# EAGLE schematic Player (EAGLE 7.5.0)

## Sheet 1 of 2
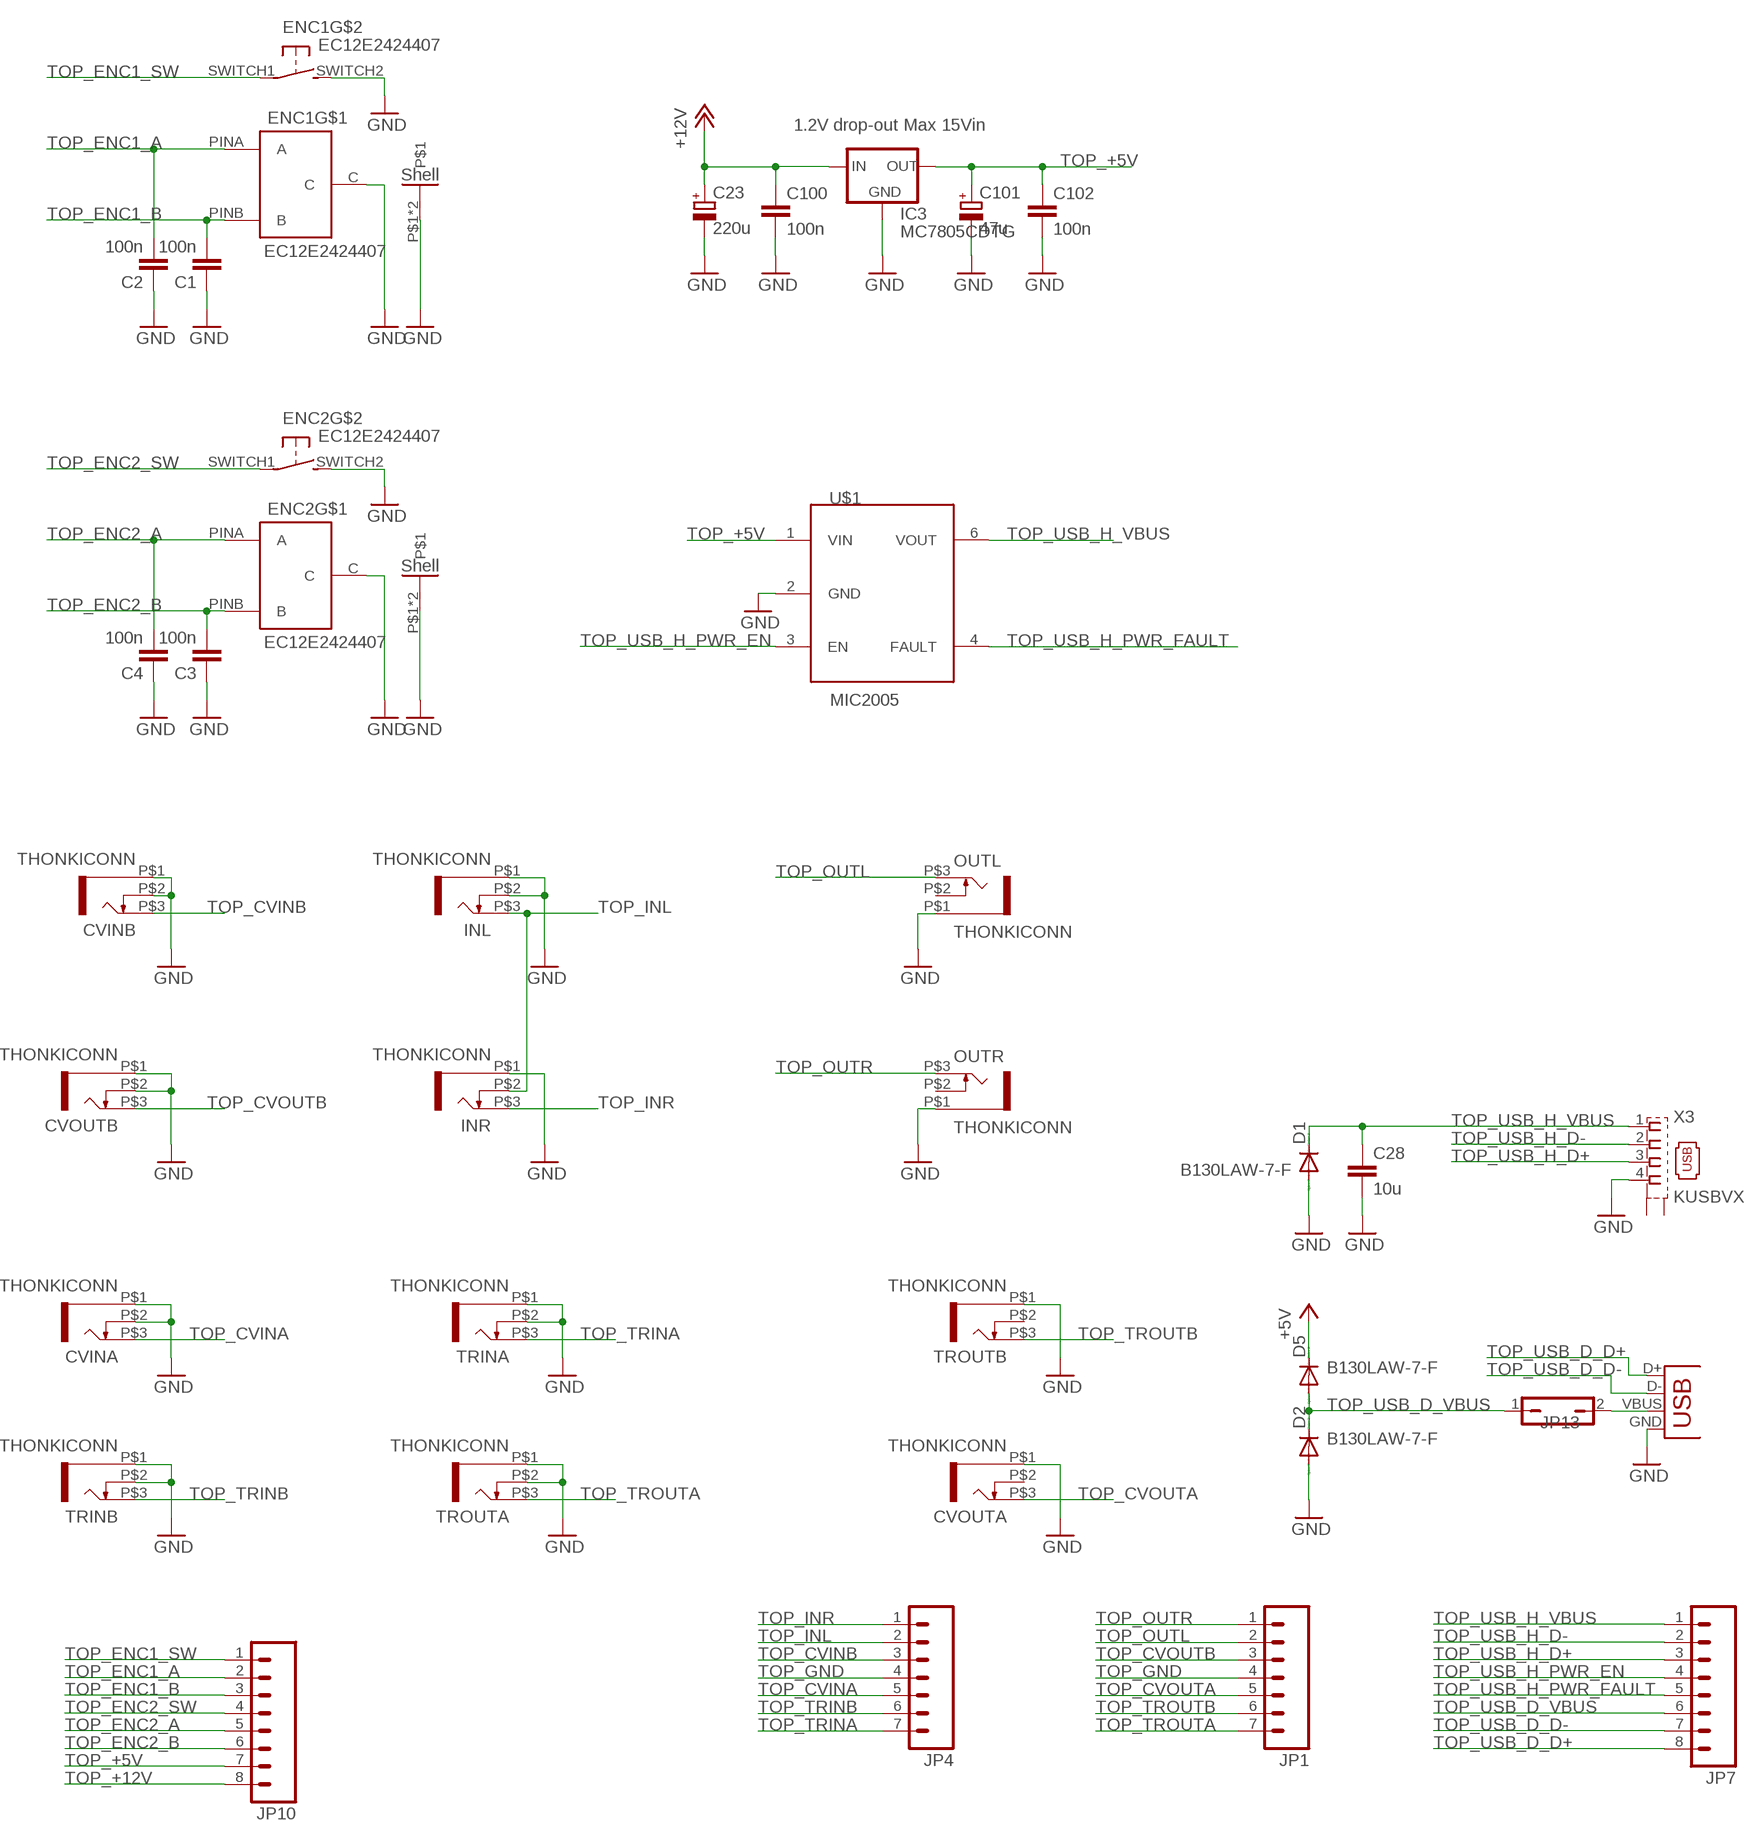
[diagram p0: schematic, sheet 1]

### Parts
C1  100n  C-EUC0603  [C0603]
C2  100n  C-EUC0603  [C0603]
C3  100n  C-EUC0603  [C0603]
C4  100n  C-EUC0603  [C0603]
C23  220u  CPOL-EUD  [PANASONIC_D]
C28  10u  C-EUC1206  [C1206]
C100  100n  C-EUC0603  [C0603]
C101  47u  CPOL-EU153CLV-0505  [CPOL-5]
C102  100n  C-EUC0603  [C0603]
CVINA  THONKICONN  [THONKICONN]
CVINB  THONKICONN  [THONKICONN]
CVOUTA  THONKICONN  [THONKICONN]
CVOUTB  THONKICONN  [THONKICONN]
D1  B130LAW-7-F  DIODE-SOD123  [SOD123]
D2  B130LAW-7-F  DIODE-SOD123  [SOD123]
D5  B130LAW-7-F  DIODE-SOD123  [SOD123]
ENC1  EC12E2424407  [EC12E2424407]
ENC2  EC12E2424407  [EC12E2424407]
IC3  MC7805CDTG  MC78XX  [DPACK]
INL  THONKICONN  [THONKICONN]
INR  THONKICONN  [THONKICONN]
JP1  M07  [1X07]
JP4  M07  [1X07]
JP7  M081X08  [1X08]
JP10  M081X08  [1X08]
JP13  JP1Q  [JP1]
OUTL  THONKICONN  [THONKICONN]
OUTR  THONKICONN  [THONKICONN]
TRINA  THONKICONN  [THONKICONN]
TRINB  THONKICONN  [THONKICONN]
TROUTA  THONKICONN  [THONKICONN]
TROUTB  THONKICONN  [THONKICONN]
U$1  MIC2005  [SOT23-6]
X3  KUSBVX  [KUSBVX]
X5  USBPTH-VERTICAL  [USB-B-PTH-VERTICAL]

### Nets
N$19: JP13.2 X5.VBUS
TOP_+5V: C101.+ C102.1 D5.C IC3.3(OUT) JP10.7 U$1.1(VIN) ; supply symbol labelled +5V
TOP_+12V: C23.+ C100.1 IC3.1(IN) JP10.8 ; supply symbol labelled +12V
TOP_CVINA: CVINA.P$3 JP4.5
TOP_CVINB: CVINB.P$3 JP4.3
TOP_CVOUTA: CVOUTA.P$3 JP1.5
TOP_CVOUTB: CVOUTB.P$3 JP1.3
TOP_ENC1_A: C2.2 ENC1.PINA(A) JP10.2
TOP_ENC1_B: C1.2 ENC1.PINB(B) JP10.3
TOP_ENC1_SW: ENC1.SWITCH1(P) JP10.1
TOP_ENC2_A: C4.2 ENC2.PINA(A) JP10.5
TOP_ENC2_B: C3.2 ENC2.PINB(B) JP10.6
TOP_ENC2_SW: ENC2.SWITCH1(P) JP10.4
TOP_GND: C1.1 C2.1 C3.1 C4.1 C23.- C28.2 C100.2 C101.- C102.2 CVINA.P$1 CVINA.P$2 CVINB.P$1 CVINB.P$2 CVOUTA.P$1 CVOUTB.P$1 CVOUTB.P$2 D1.A D2.A ENC1.C ENC1.P$1 ENC1.P$2 ENC1.SWITCH2(S) ENC2.C ENC2.P$1 ENC2.P$2 ENC2.SWITCH2(S) IC3.4(GND) INL.P$1 INL.P$2 INR.P$1 JP1.4 JP4.4 OUTL.P$1 OUTR.P$1 TRINA.P$1 TRINA.P$2 TRINB.P$1 TRINB.P$2 TROUTA.P$1 TROUTA.P$2 TROUTB.P$1 U$1.2(GND) X3.4 X5.GND ; supply symbol labelled GND
TOP_INL: INL.P$3 INR.P$2 JP4.2
TOP_INR: INR.P$3 JP4.1
TOP_OUTL: JP1.2 OUTL.P$3
TOP_OUTR: JP1.1 OUTR.P$3
TOP_TRINA: JP4.7 TRINA.P$3
TOP_TRINB: JP4.6 TRINB.P$3
TOP_TROUTA: JP1.7 TROUTA.P$3
TOP_TROUTB: JP1.6 TROUTB.P$3
TOP_USB_D_D+: JP7.8 X5.D+
TOP_USB_D_D-: JP7.7 X5.D-
TOP_USB_D_VBUS: D2.C D5.A JP7.6 JP13.1
TOP_USB_H_D+: JP7.3 X3.3
TOP_USB_H_D-: JP7.2 X3.2
TOP_USB_H_PWR_EN: JP7.4 U$1.3(EN)
TOP_USB_H_PWR_FAULT: JP7.5 U$1.4(FAULT)
TOP_USB_H_VBUS: C28.1 D1.C JP7.1 U$1.6(VOUT) X3.1
Unconnected: CVOUTA.P$2 OUTL.P$2 OUTR.P$2 TROUTB.P$2 X3.M1(S1) X3.M2(S2)

### Notes on the sheet
- 1.2V drop-out Max 15Vin

## Sheet 2 of 2
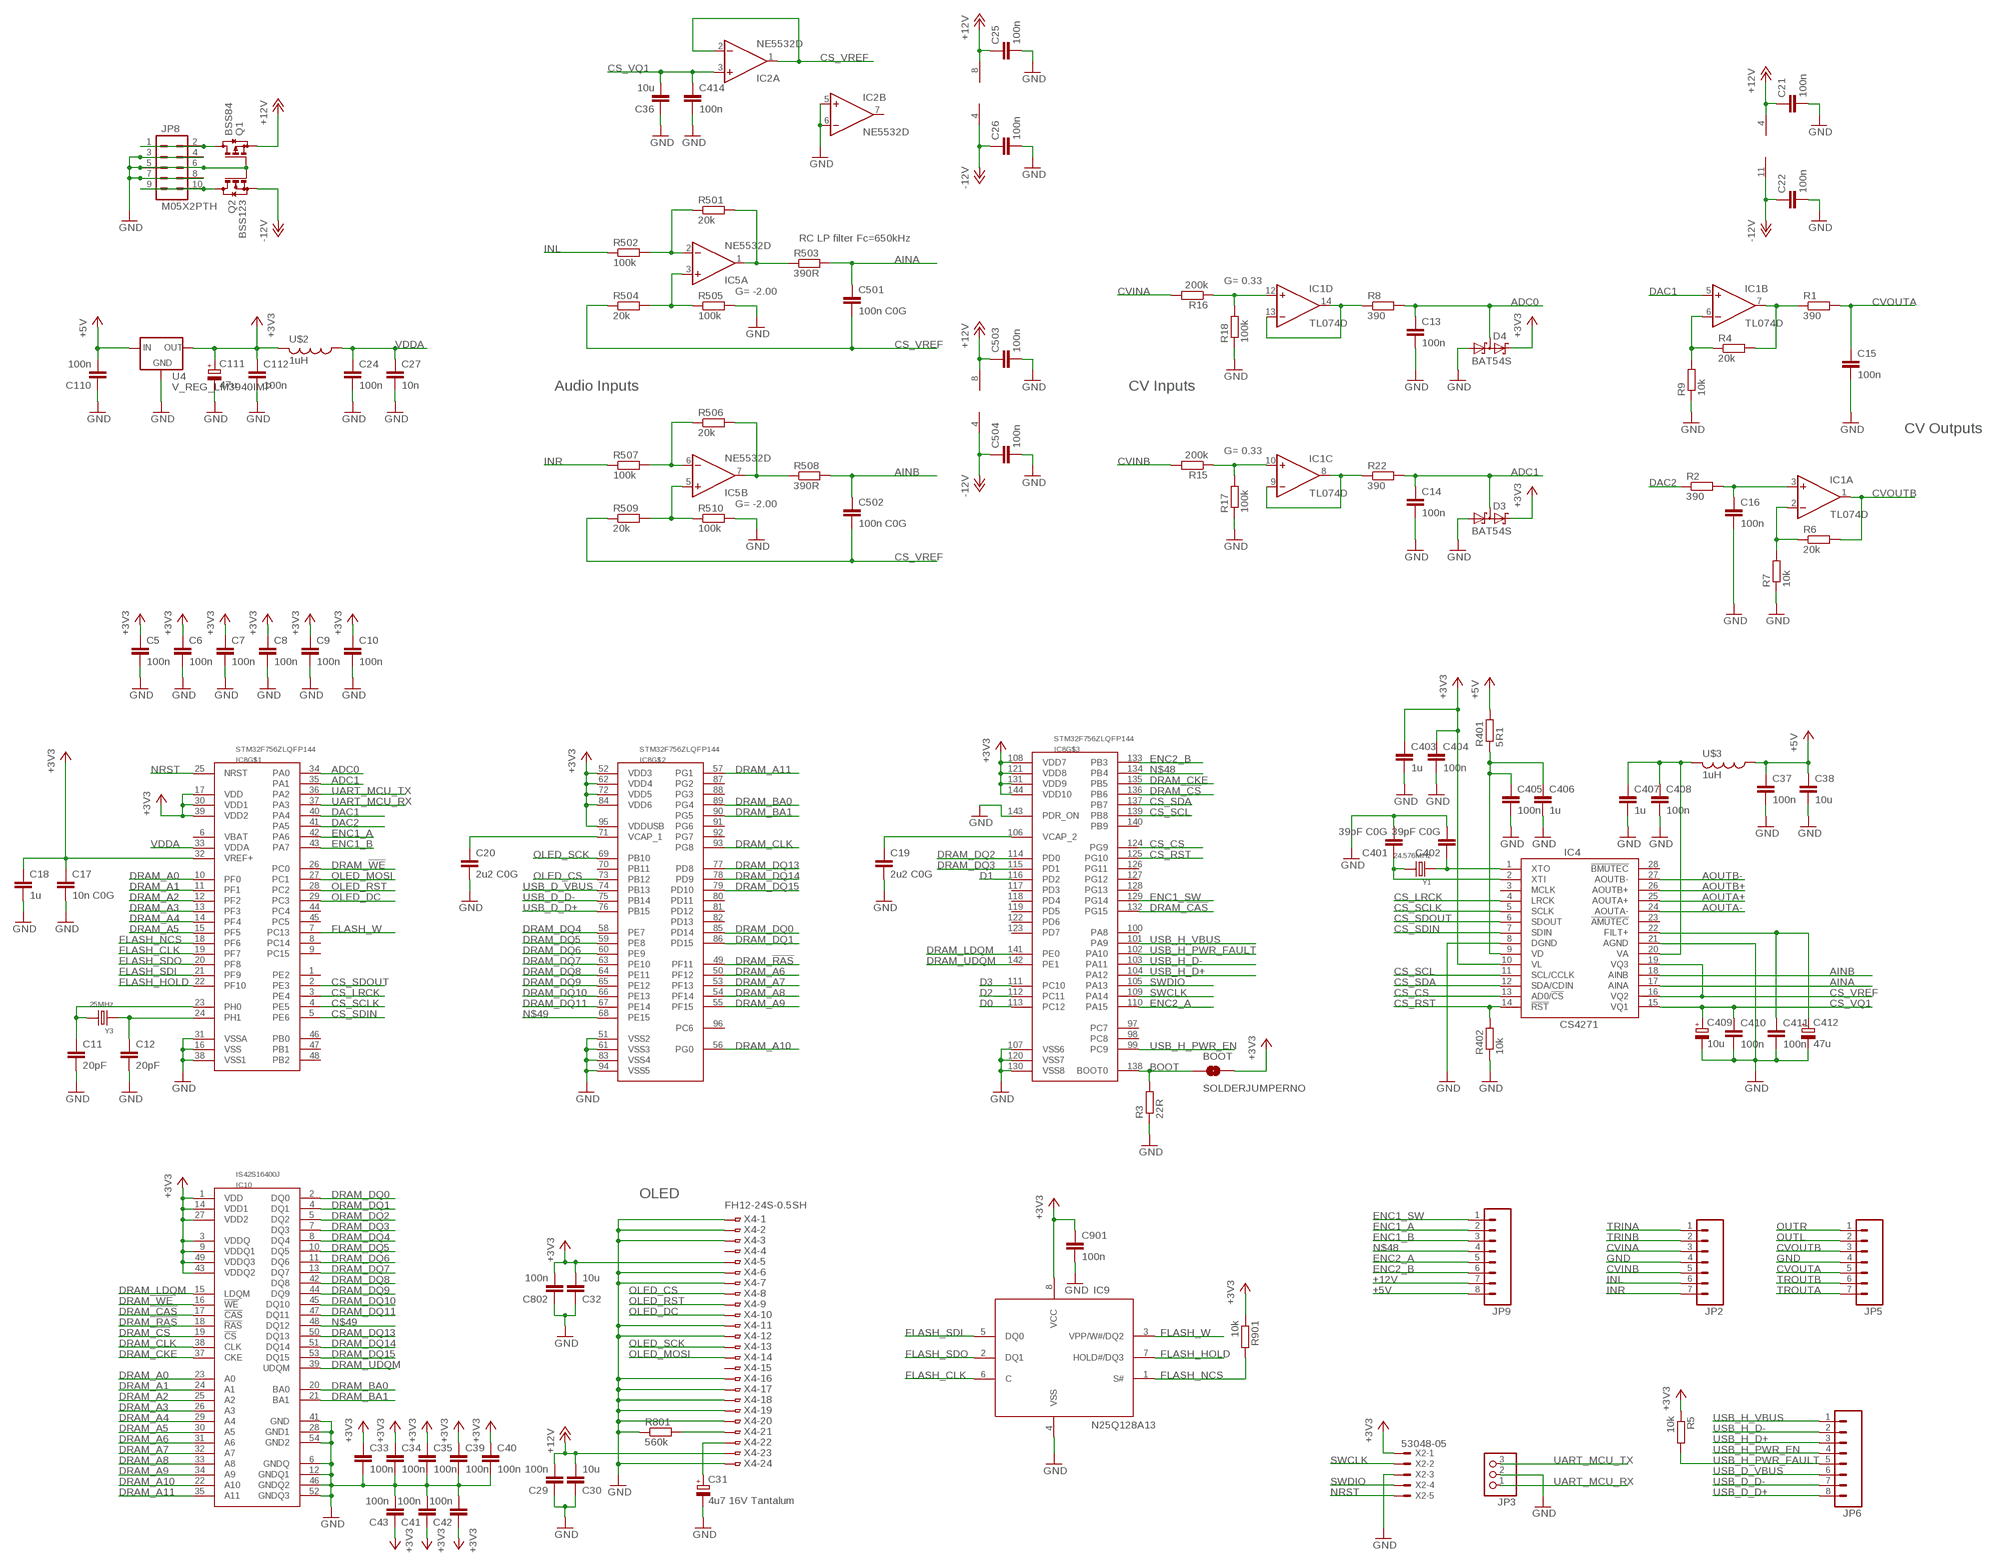
[diagram p1: schematic, sheet 2, part 1 of 2]
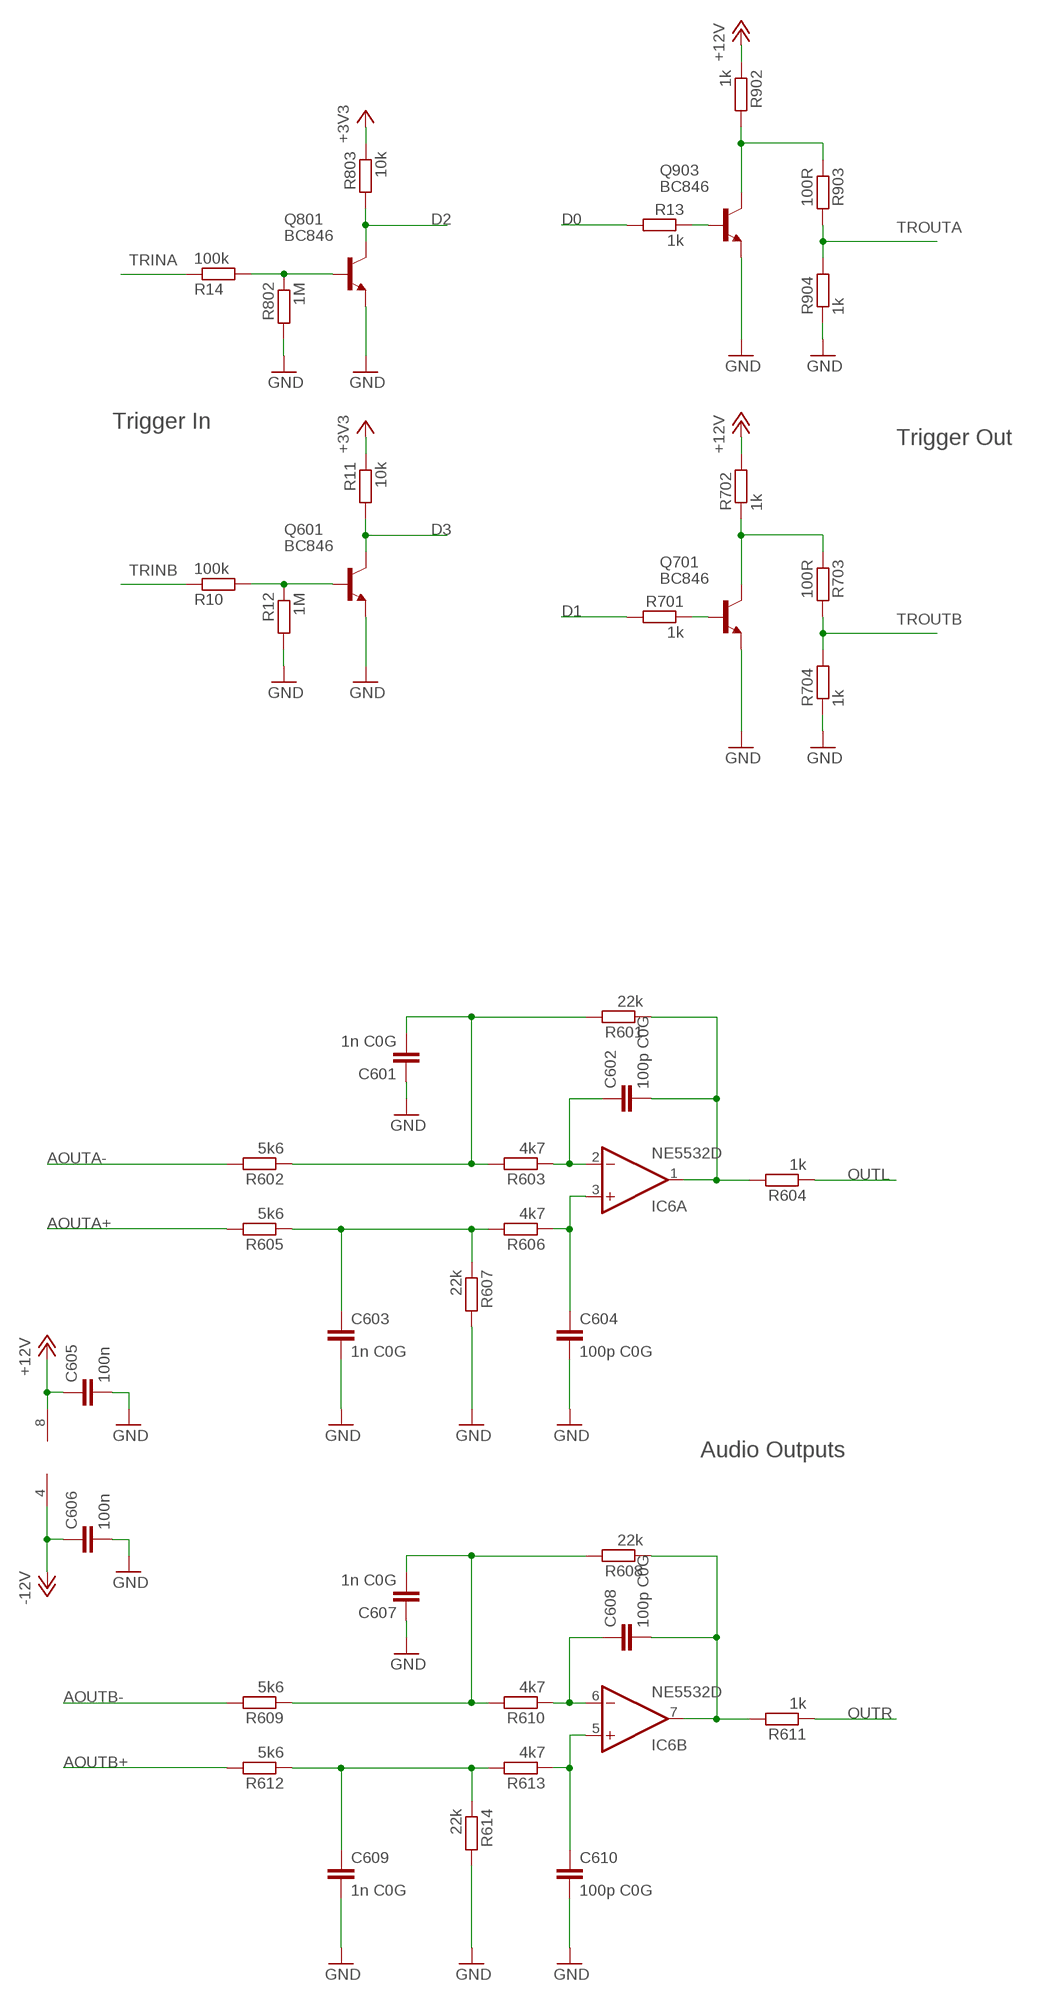
[diagram p2: schematic, sheet 2, part 2 of 2]

### Parts
BOOT  SOLDERJUMPERNO  [SJ_2S-NO]
C5  100n  C-EUC0603  [C0603]
C6  100n  C-EUC0603  [C0603]
C7  100n  C-EUC0603  [C0603]
C8  100n  C-EUC0603  [C0603]
C9  100n  C-EUC0603  [C0603]
C10  100n  C-EUC0603  [C0603]
C11  20pF  C-EUC0603  [C0603]
C12  20pF  C-EUC0603  [C0603]
C13  100n  C-EUC0603  [C0603]
C14  100n  C-EUC0603  [C0603]
C15  100n  C-EUC0603  [C0603]
C16  100n  C-EUC0603  [C0603]
C17  10n C0G  C-EUC0603  [C0603]
C18  1u  C-EUC0603  [C0603]
C19  2u2 C0G  C-EUC0603  [C0603]
C20  2u2 C0G  C-EUC0603  [C0603]
C21  100n  C-EUC0603  [C0603]
C22  100n  C-EUC0603  [C0603]
C24  100n  C-EUC0603  [C0603]
C25  100n  C-EUC0603  [C0603]
C26  100n  C-EUC0603  [C0603]
C27  10n  C-EUC0603  [C0603]
C29  100n  C-EUC0603  [C0603]
C30  10u  C-EUC1206  [C1206]
C31  4u7 16V Tantalum  CPOL-EUSMCA  [SMC_A]
C32  10u  C-EUC1206  [C1206]
C33  100n  C-EUC0603  [C0603]
C34  100n  C-EUC0603  [C0603]
C35  100n  C-EUC0603  [C0603]
C36  10u  C-EUC1206  [C1206]
C37  100n  C-EUC0603  [C0603]
C38  10u  C-EUC0603  [C0603]
C39  100n  C-EUC0603  [C0603]
C40  100n  C-EUC0603  [C0603]
C41  100n  C-EUC0603  [C0603]
C42  100n  C-EUC0603  [C0603]
C43  100n  C-EUC0603  [C0603]
C110  100n  C-EUC0603  [C0603]
C111  47u  CPOL-EU153CLV-0505  [CPOL-5]
C112  100n  C-EUC0603  [C0603]
C401  39pF C0G  C-EUC0603  [C0603]
C402  39pF C0G  C-EUC0603  [C0603]
C403  1u  C-EUC0603  [C0603]
C404  100n  C-EUC0603  [C0603]
C405  100n  C-EUC0603  [C0603]
C406  1u  C-EUC0603  [C0603]
C407  1u  C-EUC0603  [C0603]
C408  100n  C-EUC0603  [C0603]
C409  10u  CPOL-EU153CLV-0505  [CPOL-5]
C410  100n  C-EUC0603  [C0603]
C411  100n  C-EUC0603  [C0603]
C412  47u  CPOL-EU153CLV-0505  [CPOL-5]
C414  100n  C-EUC0603  [C0603]
C501  100n C0G  C-EUC0603  [C0603]
C502  100n C0G  C-EUC0603  [C0603]
C503  100n  C-EUC0603  [C0603]
C504  100n  C-EUC0603  [C0603]
C601  1n C0G  C-EUC0603  [C0603]
C602  100p C0G  C-EUC0603  [C0603]
C603  1n C0G  C-EUC0603  [C0603]
C604  100p C0G  C-EUC0603  [C0603]
C605  100n  C-EUC0603  [C0603]
C606  100n  C-EUC0603  [C0603]
C607  1n C0G  C-EUC0603  [C0603]
C608  100p C0G  C-EUC0603  [C0603]
C609  1n C0G  C-EUC0603  [C0603]
C610  100p C0G  C-EUC0603  [C0603]
C802  100n  C-EUC0603  [C0603]
C901  100n  C-EUC0603  [C0603]
D3  BAT54S  [SOT23]
D4  BAT54S  [SOT23]
IC1  TL074D  [SO14]
IC2  NE5532D  [SO08]
IC4  CS4271  [TSSOP28-0.65-9.7X4.4MM]
IC5  NE5532D  [SO08]
IC6  NE5532D  [SO08]
IC8  STM32F756ZLQFP144  [QFP50P2200X2200X160-144N]
IC9  N25Q128A13  [SO8W]
IC10  IS42S16400J  [TSOP54-400]
JP2  M07  [1X07]
JP3  CON-JST-1X03PH-TH  [JST-B3B-PH-KL]
JP5  M07  [1X07]
JP6  M081X08  [1X08]
JP8  M05X2PTH  [AVR_ICSP]
JP9  M081X08  [1X08]
Q1  BSS84  [SOT23]
Q2  BSS123  [SOT23]
Q601  BC846  [SOT23]
Q701  BC846  [SOT23]
Q801  BC846  [SOT23]
Q903  BC846  [SOT23]
R1  390  R-EU_0603  [0603]
R2  390  R-EU_0603  [0603]
R3  22R  R-EU_0603  [0603]
R4  20k  R-EU_0603  [0603]
R5  10k  R-EU_0603  [0603]
R6  20k  R-EU_0603  [0603]
R7  10k  R-EU_0603  [0603]
R8  390  R-EU_0603  [0603]
R9  10k  R-EU_0603  [0603]
R10  100k  R-EU_0603  [0603]
R11  10k  R-EU_0603  [0603]
R12  1M  R-EU_0603  [0603]
R13  1k  R-EU_0603  [0603]
R14  100k  R-EU_0603  [0603]
R15  200k  R-EU_0603  [0603]
R16  200k  R-EU_0603  [0603]
R17  100k  R-EU_0603  [0603]
R18  100k  R-EU_0603  [0603]
R22  390  R-EU_0603  [0603]
R401  5R1  R-EU_0603  [0603]
R402  10k  R-EU_0603  [0603]
R501  20k  R-EU_0603  [0603]
R502  100k  R-EU_0603  [0603]
R503  390R  R-EU_0603  [0603]
R504  20k  R-EU_0603  [0603]
R505  100k  R-EU_0603  [0603]
R506  20k  R-EU_0603  [0603]
R507  100k  R-EU_0603  [0603]
R508  390R  R-EU_0603  [0603]
R509  20k  R-EU_0603  [0603]
R510  100k  R-EU_0603  [0603]
R601  22k  R-EU_0603  [0603]
R602  5k6  R-EU_0603  [0603]
R603  4k7  R-EU_0603  [0603]
R604  1k  R-EU_0603  [0603]
R605  5k6  R-EU_0603  [0603]
R606  4k7  R-EU_0603  [0603]
R607  22k  R-EU_0603  [0603]
R608  22k  R-EU_0603  [0603]
R609  5k6  R-EU_0603  [0603]
R610  4k7  R-EU_0603  [0603]
R611  1k  R-EU_0603  [0603]
R612  5k6  R-EU_0603  [0603]
R613  4k7  R-EU_0603  [0603]
R614  22k  R-EU_0603  [0603]
R701  1k  R-EU_0603  [0603]
R702  1k  R-EU_0603  [0603]
R703  100R  R-EU_0603  [0603]
R704  1k  R-EU_0603  [0603]
R801  560k  R-EU_0603  [0603]
R802  1M  R-EU_0603  [0603]
R803  10k  R-EU_0603  [0603]
R901  10k  R-EU_0603  [0603]
R902  1k  R-EU_0603  [0603]
R903  100R  R-EU_0603  [0603]
R904  1k  R-EU_0603  [0603]
U4  V_REG_LM3940IMP  [SOT223]
U$2  1uH  INDUCTOR  [0603]
U$3  1uH  INDUCTOR  [0603]
X2  53048-05  [53048-05]
X4  FH12-24S-0.5SH  [FH12-24S-0.5SH]
Y1  24.576MHz  SMD-CRYSTAL-8MHZ-20PF-20PPM(2P-5.0X3.2MM)  [X2-SMD-5.0X3.2X1.3MM]
Y3  25MHz  SMD-CRYSTAL-8MHZ-20PF-20PPM(2P-5.0X3.2MM)  [X2-SMD-5.0X3.2X1.3MM]

### Nets
+3.3V [power]: BOOT.2 C5.1 C6.1 C7.1 C8.1 C9.1 C10.1 C17.1 C18.1 C32.2 C33.1 C34.1 C35.1 C39.1 C40.1 C41.1 C42.1 C43.1 C111.+ C112.1 C403.1 C404.1 C802.2 C901.1 D3.2(C2) D4.2(C2) IC4.10(VL) IC8.17(VDD) IC8.30(VDD1) IC8.32(VREF+) IC8.39(VDD2) IC8.52(VDD3) IC8.62(VDD4) IC8.72(VDD5) IC8.84(VDD6) IC8.95(VDDUSB) IC8.108(VDD7) IC8.121(VDD8) IC8.131(VDD9) IC8.144(VDD10) IC9.8(VCC) IC10.1(VDD) IC10.3(VDDQ) IC10.9(VDDQ1) IC10.14(VDD1) IC10.27(VDD2) IC10.43(VDDQ2) IC10.49(VDDQ3) R5.1 R11.1 R803.1 R901.1 U4.3(OUT) U$2.2 X2.1 X4.5 ; supply symbol labelled +3V3
+5V [power]: C37.1 C38.1 C110.2 JP9.8 R401.2 U4.1(IN) U$3.1
+12V: C21.1 C25.1 C29.2 C30.2 C503.1 C605.1 IC1.4(P:V+) IC2.8(P:V+) IC5.8(P:V+) IC6.8(P:V+) JP9.7 Q1.2(S) R702.2 R902.1 X4.23
-12V: C22.1 C26.1 C504.1 C606.1 IC1.11(P:V-) IC2.4(P:V-) IC5.4(P:V-) IC6.4(P:V-) Q2.2(S)
ADC0: C13.1 D4.3(C1A2) IC8.34(PA0) R8.2
ADC1: C14.1 D3.3(C1A2) IC8.35(PA1) R22.2
AINA: C501.1 IC4.17(AINA) R503.2
AINB: C502.1 IC4.18(AINB) R508.2
ANALOG_OUTA: C602.2 IC6.1(A:OUT) R601.1 R604.2
ANALOG_OUTB: C608.2 IC6.7(B:OUT) R608.1 R611.2
AOUTA+: IC4.25(AOUTA+) R605.2
AOUTA-: IC4.24(AOUTA-) R602.2
AOUTB+: IC4.26(AOUTB+) R612.2
AOUTB-: IC4.27(AOUTB-) R609.2
BOOT: BOOT.1 IC8.138(BOOT0) R3.2
CS_CS: IC4.13(AD0/!CS) IC8.124(PG9)
CS_LRCK: IC4.4(LRCK) IC8.3(PE4)
CS_RST: IC4.14(!RST) IC8.125(PG10) R402.2
CS_SCL: IC4.11(SCL/CCLK) IC8.139(PB8)
CS_SCLK: IC4.5(SCLK) IC8.4(PE5)
CS_SDA: IC4.12(SDA/CDIN) IC8.137(PB7)
CS_SDIN: IC4.7(SDIN) IC8.5(PE6)
CS_SDOUT: IC4.6(SDOUT) IC8.2(PE3)
CS_VQ1: C36.2 C409.+ C410.1 C414.1 IC2.3(A:+IN) IC4.15(VQ1)
CS_VREF: C501.2 C502.2 IC2.1(A:OUT) IC2.2(A:-IN) IC4.16(VQ2) IC4.19(VQ3) R504.1 R509.1
CVINA: JP2.3 R16.2
CVINB: JP2.5 R15.2
CVOUTA: C15.1 JP5.5 R1.2
CVOUTB: IC1.1(A:OUT) JP5.3 R6.2
D0: IC8.113(PC12) R13.2
D1: IC8.116(PD2) R701.2
D2: IC8.112(PC11) Q801.3(C) R803.2
D3: IC8.111(PC10) Q601.3(C) R11.2
DAC1: IC1.5(B:+IN) IC8.40(PA4)
DAC2: IC8.41(PA5) R2.1
DRAM_!CAS: IC8.132(PG15) IC10.17(!CAS)
DRAM_!CS: IC8.136(PB6) IC10.19(!CS)
DRAM_!RAS: IC8.49(PF11) IC10.18(!RAS)
DRAM_!WE: IC8.26(PC0) IC10.16(!WE)
DRAM_A0: IC8.10(PF0) IC10.23(A0)
DRAM_A1: IC8.11(PF1) IC10.24(A1)
DRAM_A2: IC8.12(PF2) IC10.25(A2)
DRAM_A3: IC8.13(PF3) IC10.26(A3)
DRAM_A4: IC8.14(PF4) IC10.29(A4)
DRAM_A5: IC8.15(PF5) IC10.30(A5)
DRAM_A6: IC8.50(PF12) IC10.31(A6)
DRAM_A7: IC8.53(PF13) IC10.32(A7)
DRAM_A8: IC8.54(PF14) IC10.33(A8)
DRAM_A9: IC8.55(PF15) IC10.34(A9)
DRAM_A10: IC8.56(PG0) IC10.22(A10)
DRAM_A11: IC8.57(PG1) IC10.35(A11)
DRAM_BA0: IC8.89(PG4) IC10.20(BA0)
DRAM_BA1: IC8.90(PG5) IC10.21(BA1)
DRAM_CKE: IC8.135(PB5) IC10.37(CKE)
DRAM_CLK: IC8.93(PG8) IC10.38(CLK)
DRAM_DQ0: IC8.85(PD14) IC10.2(DQ0)
DRAM_DQ1: IC8.86(PD15) IC10.4(DQ1)
DRAM_DQ2: IC8.114(PD0) IC10.5(DQ2)
DRAM_DQ3: IC8.115(PD1) IC10.7(DQ3)
DRAM_DQ4: IC8.58(PE7) IC10.8(DQ4)
DRAM_DQ5: IC8.59(PE8) IC10.10(DQ5)
DRAM_DQ6: IC8.60(PE9) IC10.11(DQ6)
DRAM_DQ7: IC8.63(PE10) IC10.13(DQ7)
DRAM_DQ8: IC8.64(PE11) IC10.42(DQ8)
DRAM_DQ9: IC8.65(PE12) IC10.44(DQ9)
DRAM_DQ10: IC8.66(PE13) IC10.45(DQ10)
DRAM_DQ11: IC8.67(PE14) IC10.47(DQ11)
DRAM_DQ13: IC8.77(PD8) IC10.50(DQ13)
DRAM_DQ14: IC8.78(PD9) IC10.51(DQ14)
DRAM_DQ15: IC8.79(PD10) IC10.53(DQ15)
DRAM_LDQM: IC8.141(PE0) IC10.15(LDQM)
DRAM_UDQM: IC8.142(PE1) IC10.39(UDQM)
ENC1_A: IC8.42(PA6) JP9.2
ENC1_B: IC8.43(PA7) JP9.3
ENC1_SW: IC8.129(PG14) JP9.1
ENC2_A: IC8.110(PA15) JP9.5
ENC2_B: IC8.133(PB3) JP9.6
FLASH_CLK: IC8.19(PF7) IC9.6(C)
FLASH_HOLD: IC8.22(PF10) IC9.7(HOLD#/DQ3)
FLASH_NCS: IC8.18(PF6) IC9.1(S#) R901.2
FLASH_SDI: IC8.21(PF9) IC9.5(DQ0)
FLASH_SDO: IC8.20(PF8) IC9.2(DQ1)
FLASH_W: IC8.7(PC13) IC9.3(VPP/W#/DQ2)
GND: C5.2 C6.2 C7.2 C8.2 C9.2 C10.2 C11.2 C12.2 C13.2 C14.2 C15.2 C16.2 C17.2 C18.2 C19.2 C20.2 C21.2 C22.2 C24.2 C25.2 C26.2 C27.2 C29.1 C30.1 C31.- C32.1 C33.2 C34.2 C35.2 C36.1 C37.2 C38.2 C39.2 C40.2 C41.2 C42.2 C43.2 C110.1 C111.- C112.2 C401.2 C402.2 C403.2 C404.2 C405.2 C406.2 C407.2 C408.2 C409.- C410.2 C411.2 C412.- C414.2 C503.2 C504.2 C601.1 C603.2 C604.2 C605.2 C606.2 C607.1 C609.2 C610.2 C802.1 C901.2 D3.1(A1) D4.1(A1) IC2.5(B:+IN) IC2.6(B:-IN) IC4.8(DGND) IC4.21(AGND) IC8.16(VSS) IC8.31(VSSA) IC8.38(VSS1) IC8.51(VSS2) IC8.61(VSS3) IC8.83(VSS4) IC8.94(VSS5) IC8.107(VSS6) IC8.120(VSS7) IC8.130(VSS8) IC8.143(PDR_ON) IC9.4(VSS) IC10.6(GNDQ) IC10.12(GNDQ1) IC10.28(GND1) IC10.41(GND) IC10.46(GNDQ2) IC10.52(GNDQ3) IC10.54(GND2) JP2.4 JP3.2 JP5.4 JP8.3 JP8.4 JP8.5 JP8.6 JP8.7 JP8.8 Q1.1(G) Q2.1(G) Q601.2(E) Q701.2(E) Q801.2(E) Q903.2(E) R3.1 R7.1 R9.1 R12.2 R17.1 R18.1 R402.1 R505.2 R510.2 R607.2 R614.2 R704.1 R801.1 R802.2 R904.1 U4.2(GND) X2.3 X4.1 X4.2 X4.3 X4.6 X4.7 X4.11 X4.12 X4.16 X4.17 X4.18 X4.19 X4.20 X4.24
INL: JP2.6 R502.1
INR: JP2.7 R507.1
N$1: C603.1 R605.1 R606.2 R607.1
N$2: IC1.12(D:+IN) R16.1 R18.2
N$3: C407.1 C408.1 IC4.20(VA) U$3.2
N$4: IC1.7(B:OUT) R1.1 R4.2
N$5: IC1.8(C:OUT) IC1.9(C:-IN) R22.1
N$6: C31.+ X4.22
N$7: JP8.9 JP8.10 Q2.3(D)
N$8: R801.2 X4.21
N$9: JP8.1 JP8.2 Q1.3(D)
N$10: C601.2 R601.2 R602.1 R603.2
N$11: C12.1 IC8.24(PH1) Y3.1
N$12: IC1.2(A:-IN) R6.1 R7.2
N$13: C602.1 IC6.2(A:-IN) R603.1
N$14: C604.1 IC6.3(A:+IN) R606.1
N$15: IC1.6(B:-IN) R4.1 R9.2
N$17: C11.1 IC8.23(PH0) Y3.2
N$18: C402.1 IC4.1(XTO) Y1.1
N$20: C411.1 C412.+ IC4.22(FILT+)
N$21: C401.1 IC4.2(XTI) Y1.2
N$25: C609.1 R612.1 R613.2 R614.1
N$26: C607.2 R608.2 R609.1 R610.2
N$27: C608.1 IC6.6(B:-IN) R610.1
N$28: C610.1 IC6.5(B:+IN) R613.1
N$30: IC1.13(D:-IN) IC1.14(D:OUT) R8.1
N$31: C16.1 IC1.3(A:+IN) R2.2
N$33: C19.1 IC8.106(VCAP_2)
N$34: C20.1 IC8.71(VCAP_1)
N$36: IC5.3(A:+IN) R504.2 R505.1
N$37: Q601.1(B) R10.2 R12.1
N$38: IC5.2(A:-IN) R501.1 R502.2
N$39: Q701.1(B) R701.1
N$40: IC5.1(A:OUT) R501.2 R503.1
N$41: Q701.3(C) R702.1 R703.1
N$42: IC5.5(B:+IN) R509.2 R510.1
N$43: IC5.6(B:-IN) R506.1 R507.2
N$45: IC5.7(B:OUT) R506.2 R508.1
N$46: IC1.10(C:+IN) R15.1 R17.2
N$47: Q903.1(B) R13.1
N$48: IC8.134(PB4) JP9.4
N$49: IC8.68(PE15) IC10.48(DQ12)
N$51: Q903.3(C) R902.2 R903.1
N$54: Q801.1(B) R14.2 R802.1
NRST: IC8.25(NRST) X2.5
OLED_CS: IC8.73(PB12) X4.8
OLED_DC: IC8.29(PC3) X4.10
OLED_MOSI: IC8.27(PC1) X4.14
OLED_RST: IC8.28(PC2) X4.9
OLED_SCK: IC8.69(PB10) X4.13
OUTL: JP5.2 R604.1
OUTR: JP5.1 R611.1
SWCLK: IC8.109(PA14) X2.2
SWDIO: IC8.105(PA13) X2.4
TRINA: JP2.1 R14.1
TRINB: JP2.2 R10.1
TROUTA: JP5.7 R903.2 R904.2
TROUTB: JP5.6 R703.2 R704.2
UART_MCU_RX: IC8.37(PA3) JP3.1
UART_MCU_TX: IC8.36(PA2) JP3.3
USB_D_D+: IC8.76(PB15) JP6.8
USB_D_D-: IC8.75(PB14) JP6.7
USB_D_VBUS: IC8.74(PB13) JP6.6
USB_H_D+: IC8.104(PA12) JP6.3
USB_H_D-: IC8.103(PA11) JP6.2
USB_H_PWR_EN: IC8.99(PC9) JP6.4
USB_H_PWR_FAULT: IC8.102(PA10) JP6.5 R5.2
USB_H_VBUS: IC8.101(PA9) JP6.1
VD: C405.1 C406.1 IC4.9(VD) R401.1
VDDA: C24.1 C27.1 IC8.33(VDDA) U$2.1
Unconnected: IC2.7(B:OUT) IC4.3(MCLK) IC4.23(!AMUTEC) IC4.28(!BMUTEC) IC8.1(PE2) IC8.6(VBAT) IC8.8(PC14) IC8.9(PC15) IC8.44(PC4) IC8.45(PC5) IC8.46(PB0) IC8.47(PB1) IC8.48(PB2) IC8.70(PB11) IC8.80(PD11) IC8.81(PD12) IC8.82(PD13) IC8.87(PG2) IC8.88(PG3) IC8.91(PG6) IC8.92(PG7) IC8.96(PC6) IC8.97(PC7) IC8.98(PC8) IC8.100(PA8) IC8.117(PD3) IC8.118(PD4) IC8.119(PD5) IC8.122(PD6) IC8.123(PD7) IC8.126(PG11) IC8.127(PG12) IC8.128(PG13) IC8.140(PB9) X4.4 X4.15

### Notes on the sheet
- RC LP filter Fc=650kHz
- G= 0.33
- G= -2.00
- Audio Inputs | CV Inputs
- CV Outputs
- G= 0.33
- G= -2.00 | Trigger In
- Trigger Out
- Audio Outputs
- OLED

## Library data of the parts
BOOT = SparkFun:SOLDERJUMPER: Solder Jumper Standard SMD solder jumper. Used to automate production. Two varients : Normally Open and Normally Closed are the same, but have different paste layers. NC will have a large amount of paste and should jumper during reflow.
C1-C22 C24-C30 C32-C43 C100 C102 C110 C112 C401-C408 C410 C411 C414 C501-C504 C601-C610 C802 C901 = Rebel:C-EU: CAPACITOR, European symbol
C23 C31 C101 C111 C409 C412 = Rebel:CPOL-EU: POLARIZED CAPACITOR, European symbol
CVINA CVINB CVOUTA CVOUTB INL INR OUTL OUTR TRINA TRINB TROUTA TROUTB = Rebel:THONKICONN
D1 D2 D5 = diode:DIODE-: DIODE; OC_FARNELL: 1858617
D3 D4 = diode:BAT54S: Schottky Diodes Pin connection corrected 2011-05-04 Source: Fairchild .. BAT54.pdf
ENC1 ENC2 = Rebel:EC12E2424407: rotary encoder with switch EC12E2424407
IC1 = linear:TL074: OP AMP
IC2 IC5 IC6 = linear:NE5532: AUDIO AMPLIFIER
IC3 = James:MC78XX: VOLTAGE REGULATOR; OC_FARNELL: 2296028
IC4 = Rebel:CS4271
IC8 = James:STM32F756Z; OC_FARNELL: 2484975
IC9 = Rebel:N25Q128A13: N25Q128A13 Flash Memory SO8W; OC_FARNELL: 2253682
IC10 = James:IS42S16400J; OC_FARNELL: 2253831
JP1 JP2 JP4 JP5 = SparkFun:M07: Header 7 Standard 7-pin 0.1" header. Use with straight break away headers (SKU : PRT-00116), right angle break away headers (PRT-00553), swiss pins (PRT-00743), machine pins (PRT-00117), and female headers (PRT-00115). NOTES ON THE VARIANTS LOCK and LOCK_LONGPADS... This footprint was designed to help hold the alignment of a through-hole component (i.e. 7-pin header) while soldering it into place. You may notice that each hole has been shifted either up or down by 0.005 of an inch from it's more standard position (which is usually a perfectly straight line). This slight alteration caused the pins (the squares in the middle) to touch the edges of the holes. Because they are alternating, it causes a "brace" to hold the header in place. 0.005 has proven to be the perfect amount of "off-center" position when using our standard breakaway headers. Although looks a little odd when you look at the bare footprint, once you have a header in there, the alteration is very hard to notice. Also, if you push a header all the way into place, it is covered up entirely on the bottom side. This idea of altering the position of holes to aid alignment will be further integrated into the Sparkfun Library for other footprints. It can help hold any component with 3 or more connection pins.
JP3 = Rebel:CON-JST-1X03
JP6 JP7 JP9 JP10 = SparkFun:M08: Header 8 Standard 8-pin 0.1" header. Use with straight break away headers (SKU : PRT-00116), right angle break away headers (PRT-00553), swiss pins (PRT-00743), machine pins (PRT-00117), and female headers (PRT-00115).
JP8 = SparkFun:M05X2: Header 5x2 Standard 10-pin dual row 0.1" header. Commonly used with AVR-ISP. Use with Spark Fun Electronics SKU: PRT-00778
JP13 = jumper:JP1Q: JUMPER
Q1 = transistor-small-signal:BSS84: P-CHANNEL MOS FET; OC_FARNELL: 1779264
Q2 = transistor-small-signal:BSS123: N-CHANNEL MOS FET; OC_FARNELL: 1843725
Q601 Q701 Q801 Q903 = transistor:BC846: NPN TRANSISTOR
R1-R18 R22 R401 R402 R501-R510 R601-R614 R701-R704 R801-R803 R901-R904 = Rebel:R-EU_: RESISTOR, European symbol
U4 = James:V_REG_LM3940IMP: LM3940IMP Fixed LDO Voltage Regulator Farnell: 1469104; OC_FARNELL: 1469104
U$1 = James:MIC2005; OC_FARNELL: 2509882
U$2 U$3 = Rebel:INDUCTOR; OC_FARNELL: 2288736
X2 = con-molex:53?-05: CONNECTOR wire to board 1.25 mm (.049 inch) pitch header; MF: MOLEX; MPN: 53048-0510; OC_FARNELL: 9732926; OC_NEWARK: 57H4722
X3 = con-kycon:KUSBVX: Vertical,Top Entry Universal Serial Bus Connector KUSBVX Series Source: KYCON Sibalco USB vertical socket KUSBV.pdf
X4 = con-hirose:FH12-24S-0.5S: 0.5mm Pitch Connectors For FPC/FFC Source: Data sheet <http://www.hirose.co.jp/cataloge_hp/e58605370.pdf>; MPN: FH12-24S-0.5SH(55); OC_FARNELL: 1324552; OC_NEWARK: 34M6170
X5 = SparkFun:USB: USB Connectors USB-B-PTH is fully proven SKU : PRT-00139 USB-miniB is fully proven SKU : PRT-00587 USB-A-PCB is untested. USB-A-H is throughly reviewed, but untested. Spark Fun Electronics SKU : PRT-00437 USB-B-SMT is throughly reviewed, but untested. Needs silkscreen touching up. USB-A-S has not been used/tested USB-MB-H has not been used/tested
Y1 Y3 = Seeed-OPL-crystal-osctllator:SMD-CRYSTAL-8MHZ-20PF-20PPM(2P-5.0X3.2MM): 306010004; MPN: 5032/2P; VALUE: 5032/2p

## Net classes
1 power: width 0.178 mm, drill 0.305 mm, clearance 0.178 mm to class 0, clearance 0.178 mm